# Altium schematic sheet ESP32.SchDoc
size A3; SheetNumber: 11; SheetTotal: 15
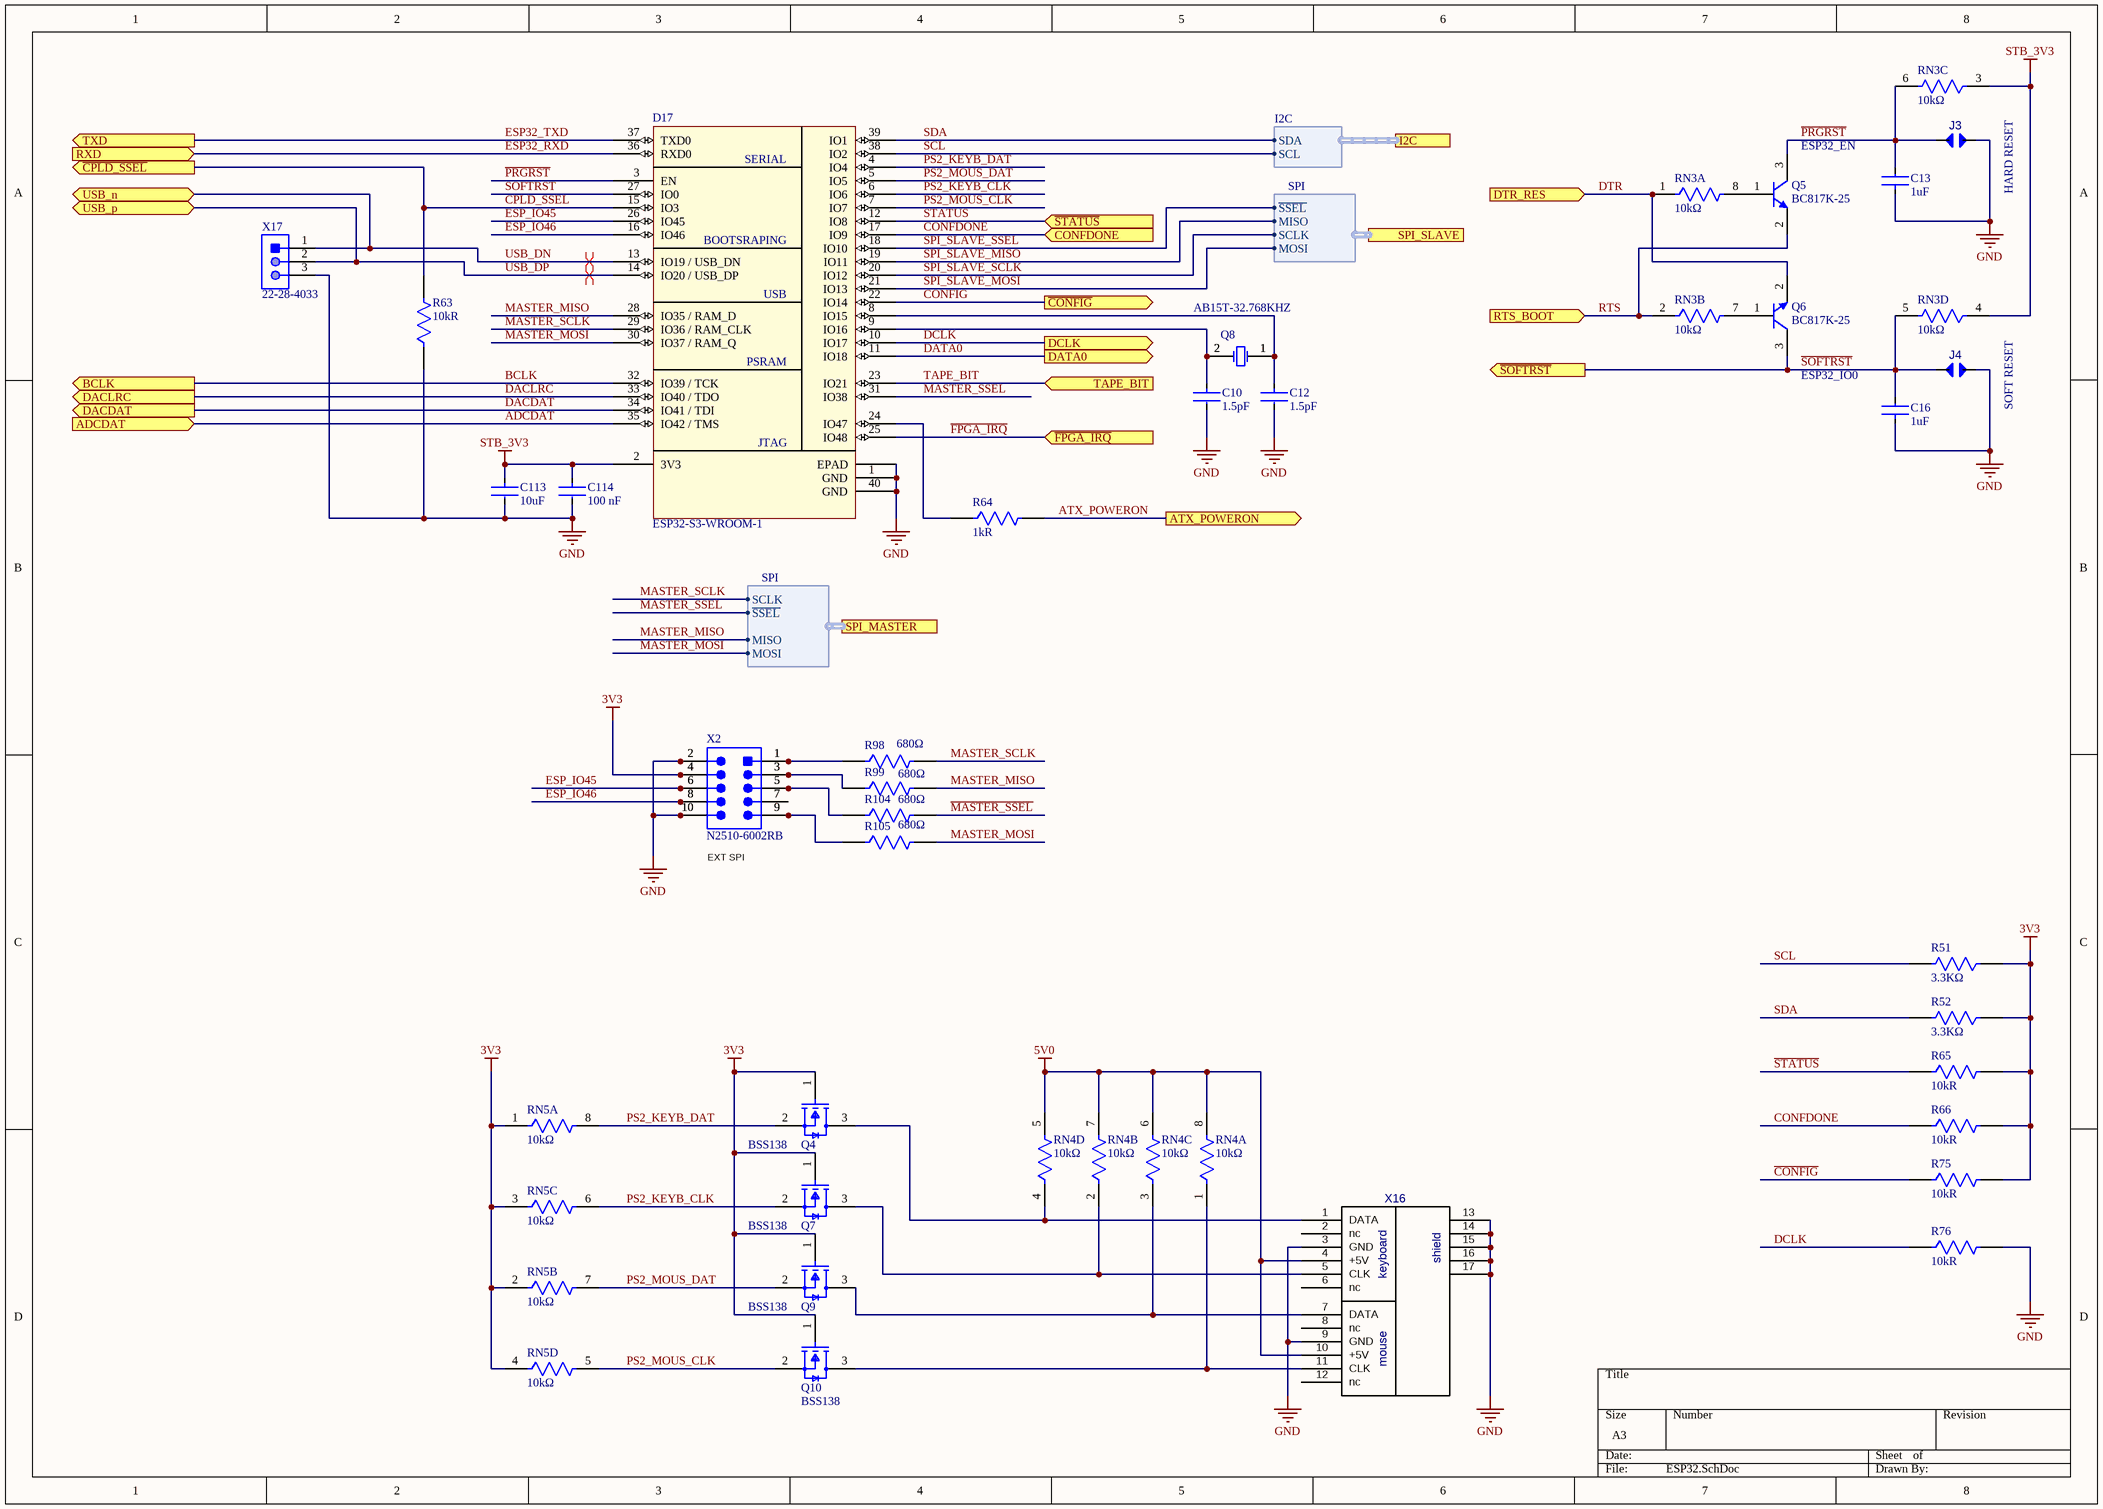
[diagram p0: ESP32.SchDoc]

## Parts
C10  Capacitance: 1.5pF  [FP-CL21-IPC_A]  (hidden comment: CL21C1R5CBANNNC)
C12  Capacitance: 1.5pF  [FP-CL21-IPC_A]  (hidden comment: CL21C1R5CBANNNC)
C13  Capacitance: 1uF  [FP-GCM21B-0_15-IPC_A]  (hidden comment: GCM21BR71E105KA56L)
C16  Capacitance: 1uF  [FP-GCM21B-0_15-IPC_A]  (hidden comment: GCM21BR71E105KA56L)
C113  Capacitance: 10uF  [FP-C0805C-DG-IPC_A]  (hidden comment: C0805C106K8PACTU)
C114  Capacitance: 100 nF  [FP-CC0805-0_85-IPC_A]  (hidden comment: CC0805KRX7R9BB104)
D17  ESP32-S3-WROOM-1  [ESP32S3WROOM1]
J3  JUMPER  [JUMPER_JUMPER(Primary)]  (value not drawn)
J4  JUMPER  [JUMPER_JUMPER(Primary)]  (value not drawn)
Q4  BSS138  [FP-318-08-IPC_B]
Q5  BC817K-25  [INF-SOT23_N]
Q6  BC817K-25  [INF-SOT23_N]
Q7  BSS138  [FP-318-08-IPC_B]
Q8  AB15T-32.768KHZ  [ABRA-AB15T-2_V]
Q9  BSS138  [FP-318-08-IPC_B]
Q10  BSS138  [FP-318-08-IPC_B]
R51  Resistance: 3.3KΩ  [FP-RT0805-IPC_A]  (hidden comment: RT0805FRE073K3L)
R52  Resistance: 3.3KΩ  [FP-RT0805-IPC_A]  (hidden comment: RT0805FRE073K3L)
R63  Resistance: 10kR  [FP-CR0805-IPC_A]  (hidden comment: CR0805-JW-103ELF)
R64  Resistance: 1kR  [FP-MCR10-IPC_A]  (hidden comment: MCR10ERTJ102)
R65  Resistance: 10kR  [FP-CR0805-IPC_A]  (hidden comment: CR0805-JW-103ELF)
R66  Resistance: 10kR  [FP-CR0805-IPC_A]  (hidden comment: CR0805-JW-103ELF)
R75  Resistance: 10kR  [FP-CR0805-IPC_A]  (hidden comment: CR0805-JW-103ELF)
R76  Resistance: 10kR  [FP-CR0805-IPC_A]  (hidden comment: CR0805-JW-103ELF)
R98  value 680Ω  [FP-RT0805-IPC_A]  (hidden comment: RT0805FRE07680RL)
R99  value 680Ω  [FP-RT0805-IPC_A]  (hidden comment: RT0805FRE07680RL)
R104  value 680Ω  [FP-RT0805-IPC_A]  (hidden comment: RT0805FRE07680RL)
R105  value 680Ω  [FP-RT0805-IPC_A]  (hidden comment: RT0805FRE07680RL)
RN3  Resistance: 10kΩ  [FP-CAT16-F4-MFG]  (hidden comment: CAT16-1002F4LF)  (parts A,B,C,D of 4)
RN4  Resistance: 10kΩ  [FP-CAT16-F4-MFG]  (hidden comment: CAT16-1002F4LF)  (parts A,B,C,D of 4)
RN5  Resistance: 10kΩ  [FP-CAT16-F4-MFG]  (hidden comment: CAT16-1002F4LF)  (parts A,B,C,D of 4)
X2  N2510-6002RB  [3M-N2510-6002-10_V]
X16  KEYB-MOUSE  [MDD-6FR]  (value not drawn)
X17  22-28-4033  [MOLX-22-28-4033_V]

## Ports
ADCDAT (in), ATX_POWERON (out), BCLK (out), CONFDONE (in), DACDAT (out), DACLRC (out), DATA0 (out), DCLK (out), DTR_RES (in), I2C (harness I2C), RTS_BOOT (in), RXD (in), SPI_MASTER (harness SPI), SPI_SLAVE (harness SPI), TAPE_BIT (in), TXD (out), USB_n (bidir), USB_p (bidir), ~{CONFIG} (out), ~{CPLD_SSEL} (out), ~{FPGA_IRQ} (in), ~{SOFTRST} (out), ~{STATUS} (in)

## Harnesses
SPI: ~{SSEL}, SCLK, MOSI, MISO
I2C: SDA, SCL

## Nets
3V3: Q4.1(G) Q7.1(G) Q9.1(G) Q10.1(G) R51.1 R52.1 R65.2 R66.2 R75.2 RN5.1 RN5.2 RN5.3 RN5.4 X2.4
5V0: RN4.5 RN4.6 RN4.7 RN4.8 X16.4(+5V) X16.10(+5V)
GND: C10.2 C12.2 C13.1 C16.1 C113.2 C114.2 D17.1(GND) D17.40(GND) D17.EPAD J3.1 J4.1 R63.1 R76.2 X2.2 X2.10 X16.3(GND) X16.9(GND) X16.13(shield) X16.14(shield) X16.15(shield) X16.16(shield) X16.17(shield) X17.3
STB_3V3: C113.1 C114.1 D17.2(3V3) RN3.3 RN3.4
ADCDAT: D17.35(IO42_/_TMS) ; port ADCDAT
ATX_POWERON: R64.2 ; port ATX_POWERON
BCLK: D17.32(IO39_/_TCK) ; port BCLK
~{CONFIG}: D17.22(IO14) R75.1 ; port ~{CONFIG}
~{CPLD_SSEL}: D17.15(IO3) R63.2 ; port ~{CPLD_SSEL}
CONFDONE: D17.17(IO9) R66.1 ; port CONFDONE
DACDAT: D17.34(IO41_/_TDI) ; port DACDAT
DACLRC: D17.33(IO40_/_TDO) ; port DACLRC
DATA0: D17.11(IO18) ; port DATA0
DCLK: D17.10(IO17) R76.1 ; port DCLK
DTR: Q6.2(E) RN3.1 ; port DTR_RES
ESP32_RXD: D17.36(RXD0) ; port RXD
ESP32_TXD: D17.37(TXD0) ; port TXD
ESP_IO45: D17.26(IO45) X2.6
ESP_IO46: D17.16(IO46) X2.8
~{FPGA_IRQ}: D17.25(IO48) ; port ~{FPGA_IRQ}
~{MASTER_SSEL}: D17.31(IO38) R104.2 ; port SPI_MASTER.~{SSEL}
MASTER_MISO: D17.28(IO35_/_RAM_D) R99.2 ; port SPI_MASTER.MISO
MASTER_MOSI: D17.30(IO37_/_RAM_Q) R105.2 ; port SPI_MASTER.MOSI
MASTER_SCLK: D17.29(IO36_/_RAM_CLK) R98.2 ; port SPI_MASTER.SCLK
~{PRGRST}: C13.2 D17.3(EN) J3.0 Q5.3(C) RN3.6
PS2_KEYB_CLK: D17.6(IO6) Q7.2(S) RN5.6
PS2_KEYB_DAT: D17.4(IO4) Q4.2(S) RN5.8
PS2_MOUS_CLK: D17.7(IO7) Q10.2(S) RN5.5
PS2_MOUS_DAT: D17.5(IO5) Q9.2(S) RN5.7
RTS: Q5.2(E) RN3.2 ; port RTS_BOOT
~{SOFTRST}: C16.2 D17.27(IO0) J4.0 Q6.3(C) RN3.5 ; port ~{SOFTRST}
~{SPI_SLAVE_SSEL}: D17.18(IO10) ; port SPI_SLAVE.~{SSEL}
~{STATUS}: D17.12(IO8) R65.1 ; port ~{STATUS}
SCL: D17.38(IO2) R51.2 ; port I2C.SCL
SDA: D17.39(IO1) R52.2 ; port I2C.SDA
SPI_SLAVE_MISO: D17.19(IO11) ; port SPI_SLAVE.MISO
SPI_SLAVE_MOSI: D17.21(IO13) ; port SPI_SLAVE.MOSI
SPI_SLAVE_SCLK: D17.20(IO12) ; port SPI_SLAVE.SCLK
TAPE_BIT: D17.23(IO21) ; port TAPE_BIT
USB_DN: D17.13(IO19_/_USB_DN) X17.1 ; port USB_n
USB_DP: D17.14(IO20_/_USB_DP) X17.2 ; port USB_p
NetC10_1: C10.1 D17.9(IO16) Q8.2(X2)
NetC12_1: C12.1 D17.8(IO15) Q8.1(X1)
NetD17_24: D17.24(IO47) R64.1
NetQ4_3: Q4.3(D) RN4.4 X16.1(DATA)
NetQ5_1: Q5.1(B) RN3.8
NetQ6_1: Q6.1(B) RN3.7
NetQ7_3: Q7.3(D) RN4.2 X16.5(CLK)
NetQ9_3: Q9.3(D) RN4.3 X16.7(DATA)
NetQ10_3: Q10.3(D) RN4.1 X16.11(CLK)
NetR98_1: R98.1 X2.1
NetR99_1: R99.1 X2.3
NetR104_1: R104.1 X2.5
NetR105_1: R105.1 X2.9

Not connected (* = marked no-connect by the designer): X2 7; X16 2(nc) 6(nc) 8(nc) 12(nc)

## Layout directives
differential pair: USB_DN, USB_DP

## Notes on the sheet
- (near Q5) ESP32_EN
- HARD RESET
- ESP32_IO0
- SOFT RESET
- (near X2) EXT SPI
- (in symbol ESP32-S3-WROOM-1) SERIAL; BOOTSRAPING; USB; PSRAM; JTAG
- (in symbol KEYB-MOUSE) keyboard; mouse

## Library data of the parts
C10 C12 = CMP-13271-001925-1: CL21 Series 0805 1.5pF 50V ±0.25pF Tolerance C0G Multilayer Ceramic Chip Capacitor; Manufacturer: Samsung; Case/Package: 0805; Manufacturer Part Number: CL21C1R5CBANNNC; value: 1.5pF; Category: Cap
C13 C16 = CMP-2007-03346-2: Ceramic Capacitor for Automotive 1uF ±10% 25VDC X7R 0805 Embossed T/R; Manufacturer: Murata; Termination: SMD/SMT; Case/Package: 0805; Manufacturer Part Number: GCM21BR71E105KA56L; value: 1uF; Category: Cap
C113 = CMP-2007-03243-2: CAP CER 10UF 10V X5R 0805; Manufacturer: KEMET; Manufacturer Part Number: C0805C106K8PACTU; Value: 10uF; Category: Cap; Case/Package: 0805
C114 = CMP-2100-03606-3: CAP CER 0.1UF 50V X7R 0805; Manufacturer: Yageo; Value: 100 nF; Category: Cap; Manufacturer Part Number: CC0805KRX7R9BB104; Case/Package: 0805
D17 = ESP32-S3-WROOM-1: 2.4 GHz Wi­Fi (802.11 b/g/n) and Bluetooth® 5 (LE) module / Built around ESP32­S3 series of SoCs, Xtensa® dual­core 32­bit LX7 microprocessor / Flash up to 16 MB, PSRAM up to 8 MB / 36 GPIOs, rich set of peripherals / Onboard PCB antenna or external antenna connector; value: ESP32-S3-WROOM-1; Case/Package: ESP32-S3; Category: IC
J3 J4 = JUMPER: HLT->~IP; Value: PLS-2; Case/Package: PLS-2; Category: Connector
Q4 Q7 Q9 Q10 = CMP-07173-000101-1: MOSFET N-CH 50V 220MA SOT-23; Manufacturer: ON Semiconductor / Fairchild; Number of Pins: 3; Case/Package: SOT-23; Termination: SMD/SMT; Manufacturer Part Number: BSS138; value: BSS138; Category: Transistor
Q5 Q6 = CMP-1177-00027-1: NPN Silicon AF Transistor, 45 V VCEO, 500 mA IC, SOT23, Reel, Green; Manufacturer: Infineon; PackageDescription: 3-Pin Small Outline Transistor Package, 1.3 x 2.9 mm Body, 0.95 mm Pitch; PartNumber: BC817K-25; Manufacturer Part Number: BC817K-25; value: BC817K-25; Case/Package: SOT-23; Category: Transistor
Q8 = CMP-1326-00001-1: Low Frequency Cylindrical Watch Crystal, 32.768 kHz, -20 to 70 degC, 2-Pin 5 x 1.4 x 1.5 mm THD, RoHS, Bulk; Manufacturer: Abracon; PackageDescription: 2-Pin THD, Body 5 x 1.4 mm, Pin Spacing 0.45 mm; PartNumber: AB15T-32.768KHZ; Manufacturer Part Number: AB15T-32.768KHZ; value: AB15T-32.768KHZ; Category: CrystalsandOscillators
R51 R52 = CMP-03412-025935-1: RES SMD 3.3K OHM 1% 1/8W 0805; Manufacturer: Yageo; Value: 3.3KΩ; Manufacturer Part Number: RT0805FRE073K3L; Category: Res; Case/Package: 0805
R63 R65 R66 R75 R76 = CMP-07231-003873-1: Thick Film Chip Resistors 0805 10kΩ 0.125W 5% 200ppm/°C; Manufacturer: Bourns; value: 10kΩ; Manufacturer Part Number: CR0805-JW-103ELF; Number of Terminations: 2; Termination: SMD/SMT; Number of Pins: 2; Case/Package: 0805; Category: Res
R64 = CMP-08839-004390-1: Thick Film Chip Resistor, 0805, 1kΩ, 5%, 200ppm/°C, 0.125W, 150V; Manufacturer: Rohm; Case/Package: 0805; Number of Terminations: 2; Manufacturer Part Number: MCR10ERTJ102; value: 1kΩ; Category: Res
R98 R99 R104 R105 = CMP-03412-000082-1: RES SMD 680 OHM 1% 1/8W 0805; Manufacturer: Yageo; Category: Res; Manufacturer Part Number: RT0805FRE07680RL; Resistance: 680Ω; Case/Package: 0805
RN3-RN5 = CMP-07230-000003-1: RES ARRAY 4 RES 10K OHM 1206; Manufacturer: Bourns; Voltage Rating: 50V; Power Rating: 0.25W; Tolerance: 1%; Number Of Resistors: 4; Value: 10kΩ; Temperature Coefficient: 200ppm/°C; Power Per Resistor: 0.0625W; Manufacturer Part Number: CAT16-1002F4LF; Category: Res; Termination: Concave; Series: CAT16; Height: 0.6mm; Device Class L2: Resistors; Digikey Description: RES ARRAY 4 RES 10K OHM 1206; ComponentLink2Description: Datasheet; Temperature Range High: +125°C; ComponentLink2URL: https://www.bourns.com/docs/Product-Datasheets/CATCAY.pdf; Temperature: -55°C to +125°C; Temperature Range Low: -55°C; Octopart: https://octopart.com/cat16-1002f4lf-bourns-1624551; Mouser Description: Resistor Networks & Arrays 10K 1% Concave 4resistors; RoHS: TRUE; Device Class L1: Passive Components; Lead Free: Yes; Automotive: No; Package: CAT16-F4; Device Class L3: Resistor Arrays
X2 = CMP-2000-06794-1: Male Header, Pitch 2.54 mm, 2 x 5 Postion, Height 9.91 mm, Tail Length 2.84 mm, -55 to 105 degC, RoHS, Bulk; PartNumber: N2510; Manufacturer: 3M; Pitch: 2.54mm; value: 10-Pin Shrouded Header, 2.54mm; Manufacturer Part Number: N2510-6002RB; Case/Package: IDC-10; Category: Connector
X17 = CMP-1676-00001-5: Male Header, Pitch 2.54 mm, 1 x 3 Position, Height 8.38 mm, Tail Length 3.18 mm, RoHS, Bulk; Manufacturer: Molex; value: header 3 pin, 2.54mm; PackageDescription: Male Header, Pitch 2.54 mm, 1 x 3 Position, Height 8.38 mm, Tail Length 3.18 mm; Manufacturer Part Number: 22-28-4033; Case/Package: PLS-3; Category: Connector
X16 = KEYB-MOUSE: Value: KEYB-MOUSE; Case/Package: Stacked Mini DIN; Category: Connector